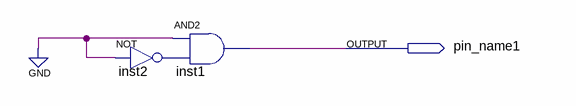
[diagram p0: schematic sheet]
// Quartus schematic qwerty.bdf as structural Verilog: 2 symbols, 1 pins
module qwerty (
  output pin_name1
);

  wire inst2_out;

  not inst2 (inst2_out, 1'b0);
  and inst1 (pin_name1, 1'b0, inst2_out);
endmodule
